# Altium schematic sheet LT3762EUFD.SchDoc: 60V SYNCHRONOUS BOOST LED CONTROLLER
size 375 x 292 mm; Date: <DATE>; DATE1: <DATE>; PCB DESIGNER: KIM T.; ECO: 1; Drawn: KIM T.; Page Number: 1; Cage Code: WITH PROGRAMMABLE CURRENT LIMIT; FAB: 1ST PROTOTYPE; APP. ENG.: TIGER Z.; Page Count: 1; SIZE: N/A; RevCode: 4; DWG NAME: LT3762EUFD; Doc: DC2342A; DsnPath: D:\Projects\LT3762_Board\DC2342A\DC2342A-4.DSN; SchematicName: DC2342A-4; PageName: LT3762EUFD; PageSize: Custom; TopSchematic: True; SPICEModelCacheTEYFTZDY: <root> / <DocumentId>TEYFTZDY</DocumentId> / <CacheFrame Number="0"> / <Model Name="4828_74408942470_47u" Kind="CKT"> / <Text>******* / .subckt 4828_74408942470_47u 1 2 / Rp 1 2 12539 / Cp 1 2 6.04294p / Rs 1 N3 0.515 / L1 N3 2 47u / .ends 4828_74408942470_47u</Text> / </Model> / <Model Name="1890_74435561100_10u" Kind="CKT"> / <Text>******* / .subckt 1890_74435561100_10u 1 2 / Rp 1 2 1459 / Cp 1 2 9.409p / Rs 1 N3 0.0069 / L1 N3 2 10u / .ends 1890_74435561100_10u</Text> / </Model> / </CacheFrame> / </root>
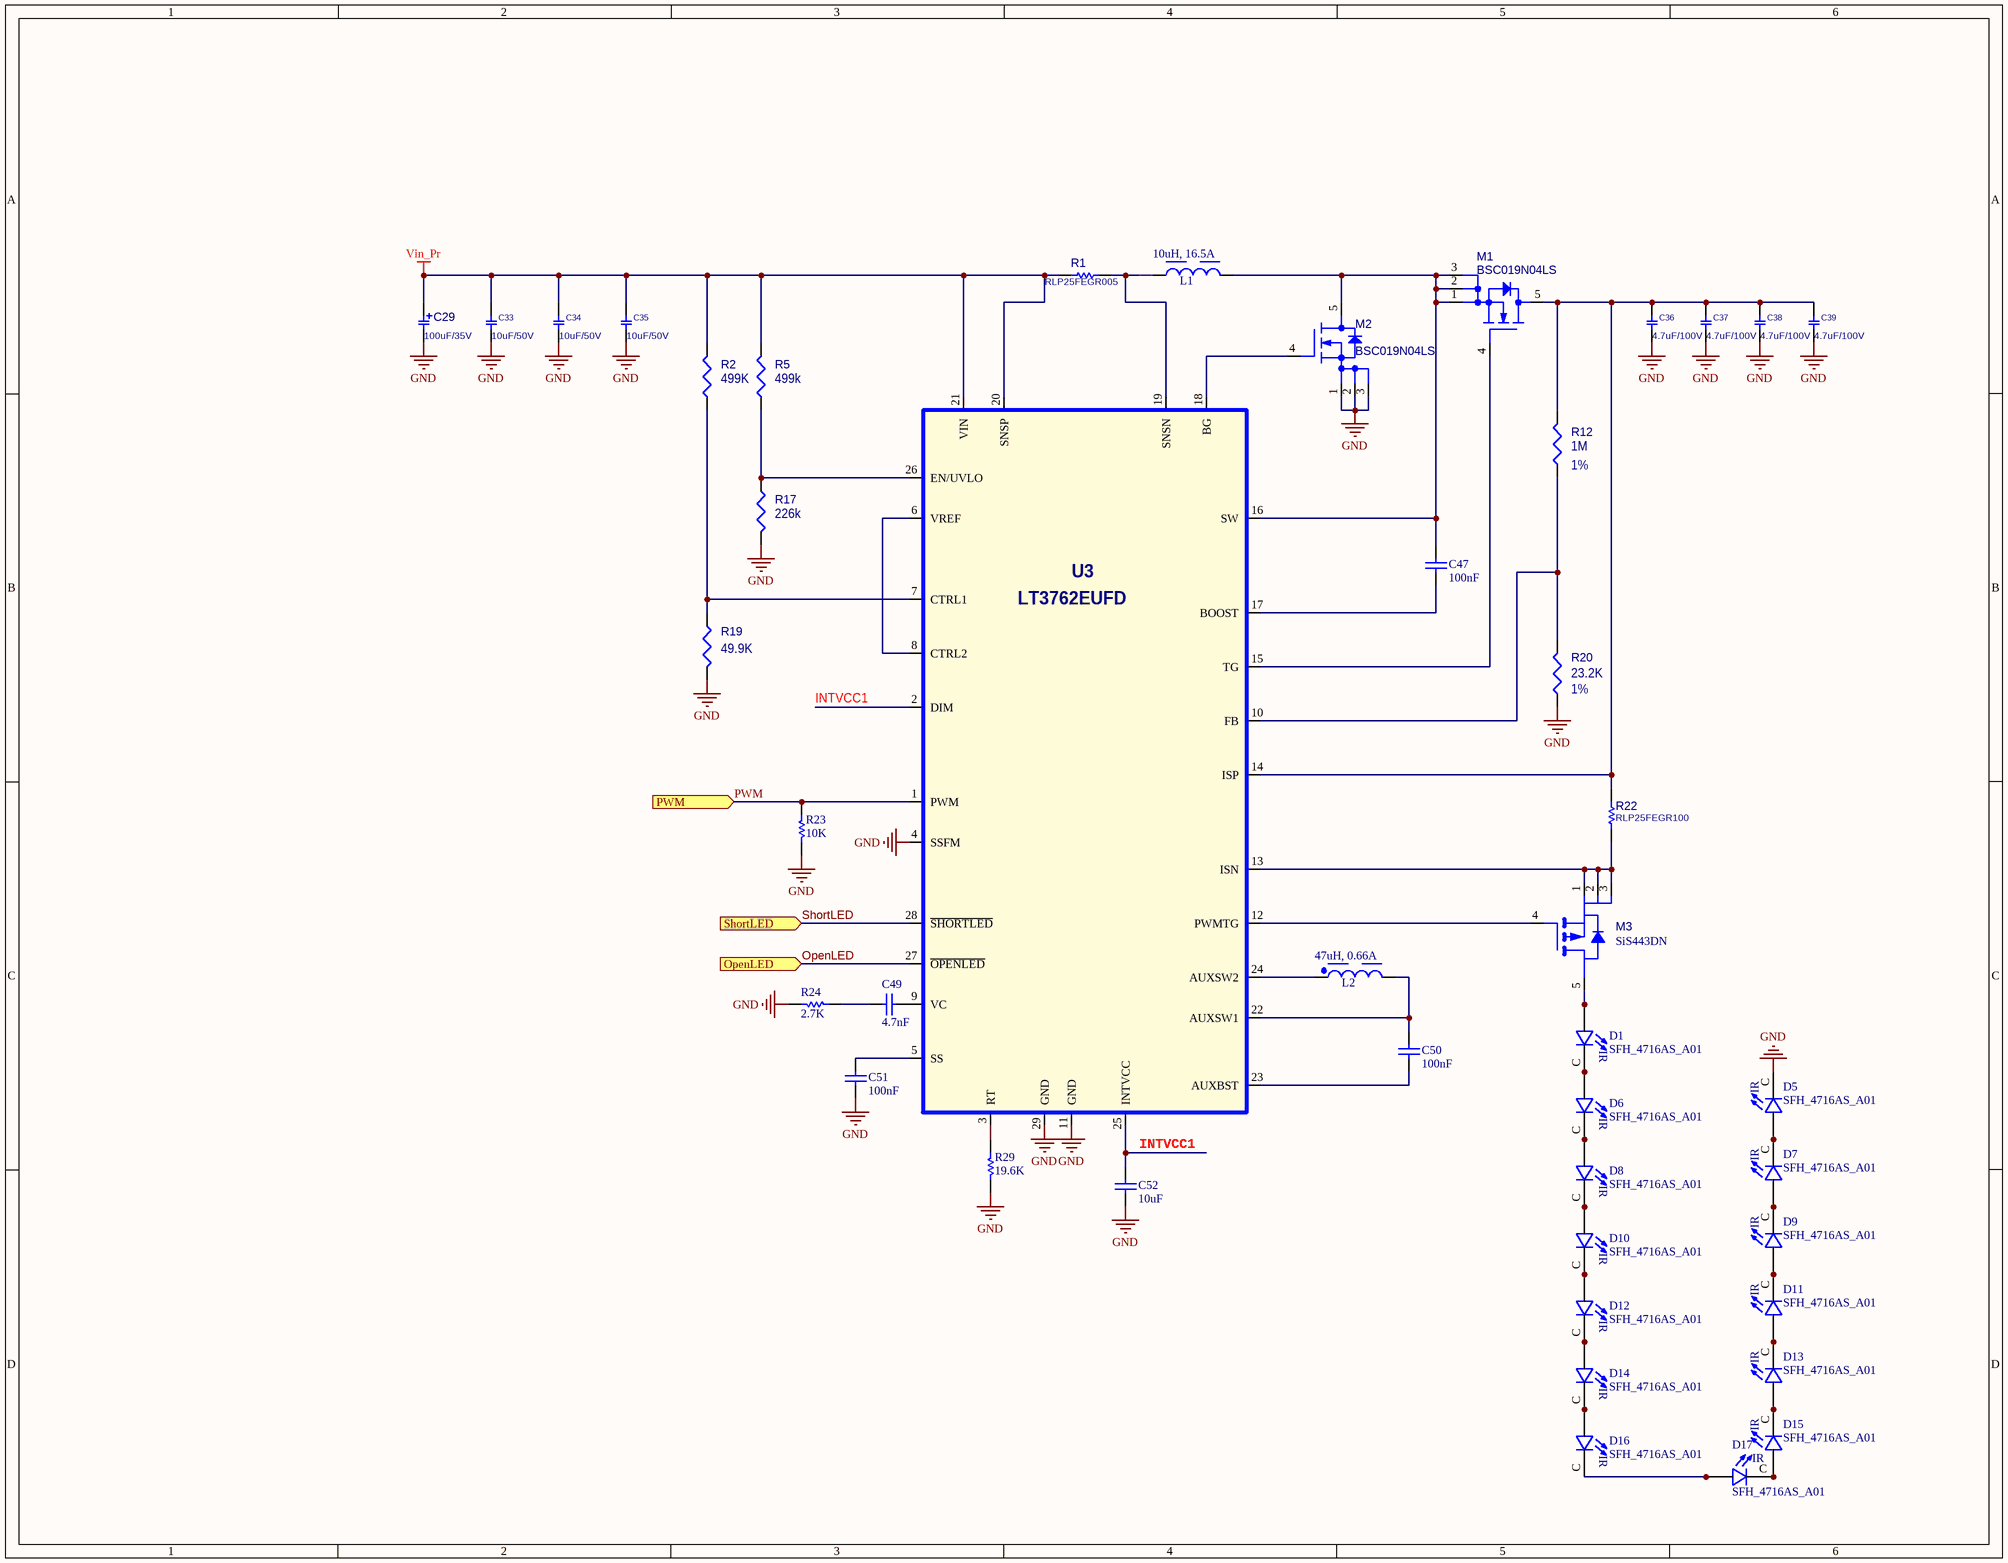
[diagram p0: LT3762EUFD.SchDoc]

## Parts
C29  100uF/35V  [C_EL_D8L10]
C33  10uF/50V  [C1210]
C34  10uF/50V  [C1210]
C35  10uF/50V  [C1210]
C36  4.7uF/100V  [C1210]
C37  4.7uF/100V  [C1210]
C38  4.7uF/100V  [C1210]
C39  4.7uF/100V  [C1210]
C47  100nF  [C0603]
C49  4.7nF  [C0603]
C50  100nF  [C0603]
C51  100nF  [C0603]
C52  10uF  [C0603]
D1  SFH_4716AS_A01  [LED_SFH_4716AS_A01]
D5  SFH_4716AS_A01  [LED_SFH_4716AS_A01]
D6  SFH_4716AS_A01  [LED_SFH_4716AS_A01]
D7  SFH_4716AS_A01  [LED_SFH_4716AS_A01]
D8  SFH_4716AS_A01  [LED_SFH_4716AS_A01]
D9  SFH_4716AS_A01  [LED_SFH_4716AS_A01]
D10  SFH_4716AS_A01  [LED_SFH_4716AS_A01]
D11  SFH_4716AS_A01  [LED_SFH_4716AS_A01]
D12  SFH_4716AS_A01  [LED_SFH_4716AS_A01]
D13  SFH_4716AS_A01  [LED_SFH_4716AS_A01]
D14  SFH_4716AS_A01  [LED_SFH_4716AS_A01]
D15  SFH_4716AS_A01  [LED_SFH_4716AS_A01]
D16  SFH_4716AS_A01  [LED_SFH_4716AS_A01]
D17  SFH_4716AS_A01  [LED_SFH_4716AS_A01]
L1  10uH, 16.5A  [WE-HCI_1890]
L2  47uH, 0.66A  [WE-SPC_4828]
M1  BSC019N04LS  [PG-TDSON-8]
M2  BSC019N04LS  [PG-TDSON-8]
M3  SiS443DN  [POWERPAK-1212-8-S-5P]
R1  RLP25FEGR005  [R2512]
R2  499K  [R0603]
R5  499k  [R0603]
R12  1M  6th Part Field: 1%  [R0603]
R17  226k  [R0603]
R19  49.9K  [R0603]
R20  23.2K  6th Part Field: 1%  [R0603]
R22  RLP25FEGR100  [R2512]
R23  10K  [R0603]
R24  2.7K  [R0603]
R29  19.6K  [R0603]
U3  LT3762EUFD  [QFN-28-4X5]

## Ports
OpenLED (in), PWM (in), ShortLED (in)

## Nets
GND: C29.2 C33.1 C34.1 C35.1 C36.1 C37.1 C38.1 C39.1 C51.2 C52.2 D5.C M2.1(SOURCE) M2.2(SOURCE) M2.3(SOURCE) R17.1 R19.2 R20.1 R23.2 R24.2 R29.2 U3.4(SSFM) U3.11(GND) U3.29(GND)
Vin_Pr: C29.1 C33.2 C34.2 C35.2 R1.1 R2.2 R5.2 U3.20(SNSP) U3.21(VIN)
INTVCC1: C52.1 U3.2(DIM) U3.25(INTVCC)
OpenLED: U3.27(~{OPENLED}) ; port OpenLED
PWM: R23.1 U3.1(PWM) ; port PWM
ShortLED: U3.28(~{SHORTLED}) ; port ShortLED
NetC36_2: C36.2 C37.2 C38.2 C39.2 M1.5(DRAIN) R12.2 R22.2 U3.14(ISP)
NetC47_1: C47.1 L1.2 M1.1(SOURCE) M1.2(SOURCE) M1.3(SOURCE) M2.5(DRAIN) U3.16(SW)
NetC47_2: C47.2 U3.17(BOOST)
NetC49_1: C49.1 U3.9(VC)
NetC49_2: C49.2 R24.1
NetC50_1: C50.1 L2.2 U3.22(AUXSW1)
NetC50_2: C50.2 U3.23(AUXBST)
NetC51_1: C51.1 U3.5(SS)
NetD1_A1: D1.A1(A) D1.A2(A) M3.5
NetD1_C: D1.C D6.A1(A) D6.A2(A)
NetD5_A1: D5.A1(A) D5.A2(A) D7.C
NetD6_C: D6.C D8.A1(A) D8.A2(A)
NetD7_A1: D7.A1(A) D7.A2(A) D9.C
NetD8_C: D8.C D10.A1(A) D10.A2(A)
NetD9_A1: D9.A1(A) D9.A2(A) D11.C
NetD10_C: D10.C D12.A1(A) D12.A2(A)
NetD11_A1: D11.A1(A) D11.A2(A) D13.C
NetD12_C: D12.C D14.A1(A) D14.A2(A)
NetD13_A1: D13.A1(A) D13.A2(A) D15.C
NetD14_C: D14.C D16.A1(A) D16.A2(A)
NetD15_A1: D15.A1(A) D15.A2(A) D17.C
NetD16_C: D16.C D17.A1(A) D17.A2(A)
NetL1_1: L1.1 R1.2 U3.19(SNSN)
NetL2_1: L2.1 U3.24(AUXSW2)
NetM1_4: M1.4(GATE) U3.15(TG)
NetM2_4: M2.4(GATE) U3.18(BG)
NetM3_1: M3.1 M3.2 M3.3 R22.1 U3.13(ISN)
NetM3_4: M3.4 U3.12(PWMTG)
NetR2_1: R2.1 R19.1 U3.7(CTRL1)
NetR5_1: R5.1 R17.2 U3.26(EN/UVLO)
NetR12_1: R12.1 R20.2 U3.10(FB)
NetR29_1: R29.1 U3.3(RT)
NetU3_6: U3.6(VREF) U3.8(CTRL2)

## Notes on the sheet
- (in symbol SFH_4716AS_A01) IR

## Library data of the parts
C29 = CAP_SMD_EL_220uF_35v: CAP, SMD, ELEC,; MANF_P#: MANF_PART#; DESC: DESCRIPTION; DIST#: MOUSER; PARAM: 20%; PARAM2: 35v; VALUE: 220uF; PRICE: 10= -$; MANF: MANF; ASSEMBLY: ASSEMBLY
C33-C39 = CAP_SMD_MLCC_1210: CAP, MLCC; PARAM: -, -%; MANF_P#: MANF_PART#; PARAM2: -V; VALUE: -F; PN: GRM32ER71H106KA12L; PRICE: 100= 1$; MANF: -; ASSEMBLY: ASSEMBLY
C47 C50 C51 = CAP: Published: 8-Jun-2000; Revision: July-2002: Re-released for DXP Platform.; Publisher: Altium Limited; Value: 100nF
C49 C52 = CAP: Value: 100nF; Published: 8-Jun-2000; Revision: July-2002: Re-released for DXP Platform.; Publisher: Altium Limited
D1 D5-D17 = SFH_4716AS_A01: OSLON Black Series (850 nm) - 150Â°; Package: None; Price: None; Value: *; MP: SFH_4716AS_A01; Availability: Unavailable
L1 = 74435561100: WE-HCI SMT Flat Wire High Current Inductor, size 1890, 10uH, 16.5A, 6.9mOhm; Manufacturer: Wurth Elektronik; Case/Size Code: 1890; Material: WE-PERM 2; Saturation Current: 21.5A; Self Resonant Frequency: 14MHz; PN: Wurth Elektronik 74435561100; Manufacturer Part Number: 74435561100; Category: Power Inductors; Match Code: WE-HCI; ComponentLink1Description: Website Link; ComponentLink1URL: https://www.we-online.com/redexpert/article/74435561100?ad; ComponentLink2Description: Datasheet Link; ComponentLink2URL: https://www.we-online.com/redexpert/spec/74435561100?ad; Mount: Surface Mount; Operating Temperature Max: 150°C; Operating Temperature Min: -40°C; Packaging: Tape and Reel; Length: 18.2mm; Width: 18.2mm; Height: 8.9mm; DC Resistance: 6.9mOhm; Inductance: 10uH; Performance Rated Current: 16.5A
L2 = 74408942470: WE-SPC SMT Power Inductor, size 4828, 47uH, 0.66A, 0.608Ohm; Manufacturer: Wurth Elektronik; Case/Size Code: 4828; DC Resistance: 0.515Ohm; Saturation Current: 1A; Self Resonant Frequency: 10MHz; PN: Wurth Elektronik 74408942470; Manufacturer Part Number: 74408942470; Category: Power Inductors; Match Code: WE-SPC; ComponentLink1Description: Website Link; ComponentLink1URL: https://www.we-online.com/redexpert/article/74408942470?ad; ComponentLink2Description: Datasheet Link; ComponentLink2URL: https://www.we-online.com/redexpert/spec/74408942470?ad; Mount: Surface Mount; Operating Temperature Max: 125°C; Operating Temperature Min: -40°C; Packaging: Tape and Reel; Length: 4.8mm; Width: 4.8mm; Height: 2.8mm; DC Resistance Max: 0.608Ohm; Inductance: 47uH; Rated Current: 0.66A
M1 = 2N7000_6: Part Reference: M2; Value: BSC019N04LS; PCB Footprint: PG-TDSON-8
M2 = 2N7000_6: Part Reference: M1; Value: BSC019N04LS; PCB Footprint: PG-TDSON-8
M3 = SI4463BDY_1: 7TH PART FIELD: P-MOSFET; 4TH PART FIELD: VISHAY; Part Reference: M5; 5TH PART FIELD: Si4463BDY; Value: SiS443DN; PCB Footprint: POWERPAK-1212-8-S-5P
R1 = RES_SMD_2512: 3W 5mΩ ±50ppm/℃ ±1% 2512 Current Sense Shunt Resistors; PARAM: 1%, 1W; DESC: DESCRIPTION; DIST#: MOUSER; VALUE: 10K; MANF_P#: -; MANF: -; ASSEMBLY: ASSEMBLY; PRICE: -; PARAM2: -
R2 = RES0402: 7th Part Field: Res.,; 3rd Part Field: 0603; Part Reference: R3; Value: 1M; PCB Footprint: 0603
R5 = RES0402: 7th Part Field: Res.,; 3rd Part Field: 0603; Part Reference: R2; Value: 499k; PCB Footprint: 0603
R12 = RES0402: 7th Part Field: Res.,; 3rd Part Field: 0603; Part Reference: R16; Value: 1M; PCB Footprint: 0603
R17 = RES0402: 7th Part Field: Res.,; 3rd Part Field: 0603; Part Reference: R5; Value: 226k; PCB Footprint: 0603
R19 = RES0402: 7th Part Field: Res.,; 3rd Part Field: 0603; Part Reference: R4; Value: 205k; PCB Footprint: 0603
R20 = RES0402: 7th Part Field: Res.,; 3rd Part Field: 0603; Part Reference: R17; Value: 36.5k; PCB Footprint: 0603
R22 = RES_SMD_2512: 3W 100mΩ ±50ppm/℃ ±1% 2512 Current Sense Shunt Resistors; PARAM: 1%, 1W; DESC: DESCRIPTION; DIST#: MOUSER; VALUE: 10K; MANF_P#: -; MANF: -; ASSEMBLY: ASSEMBLY; PRICE: -; PARAM2: -
R23 R24 R29 = Res1: Value: 1K; Published: 8-Jun-2000; Revision: July-2002: Re-released for DXP Platform.; Publisher: Altium Limited
U3 = LT3932EFE_37: Part Reference: U1; Value: LT3762EUFD; PCB Footprint: QFN-28-4X5